# Altium schematic sheet blackfin_e_lcd_keypad.SchDoc: LCD, Keypad, Assembly
size A3; SheetNumber: 5; SheetTotal: 6
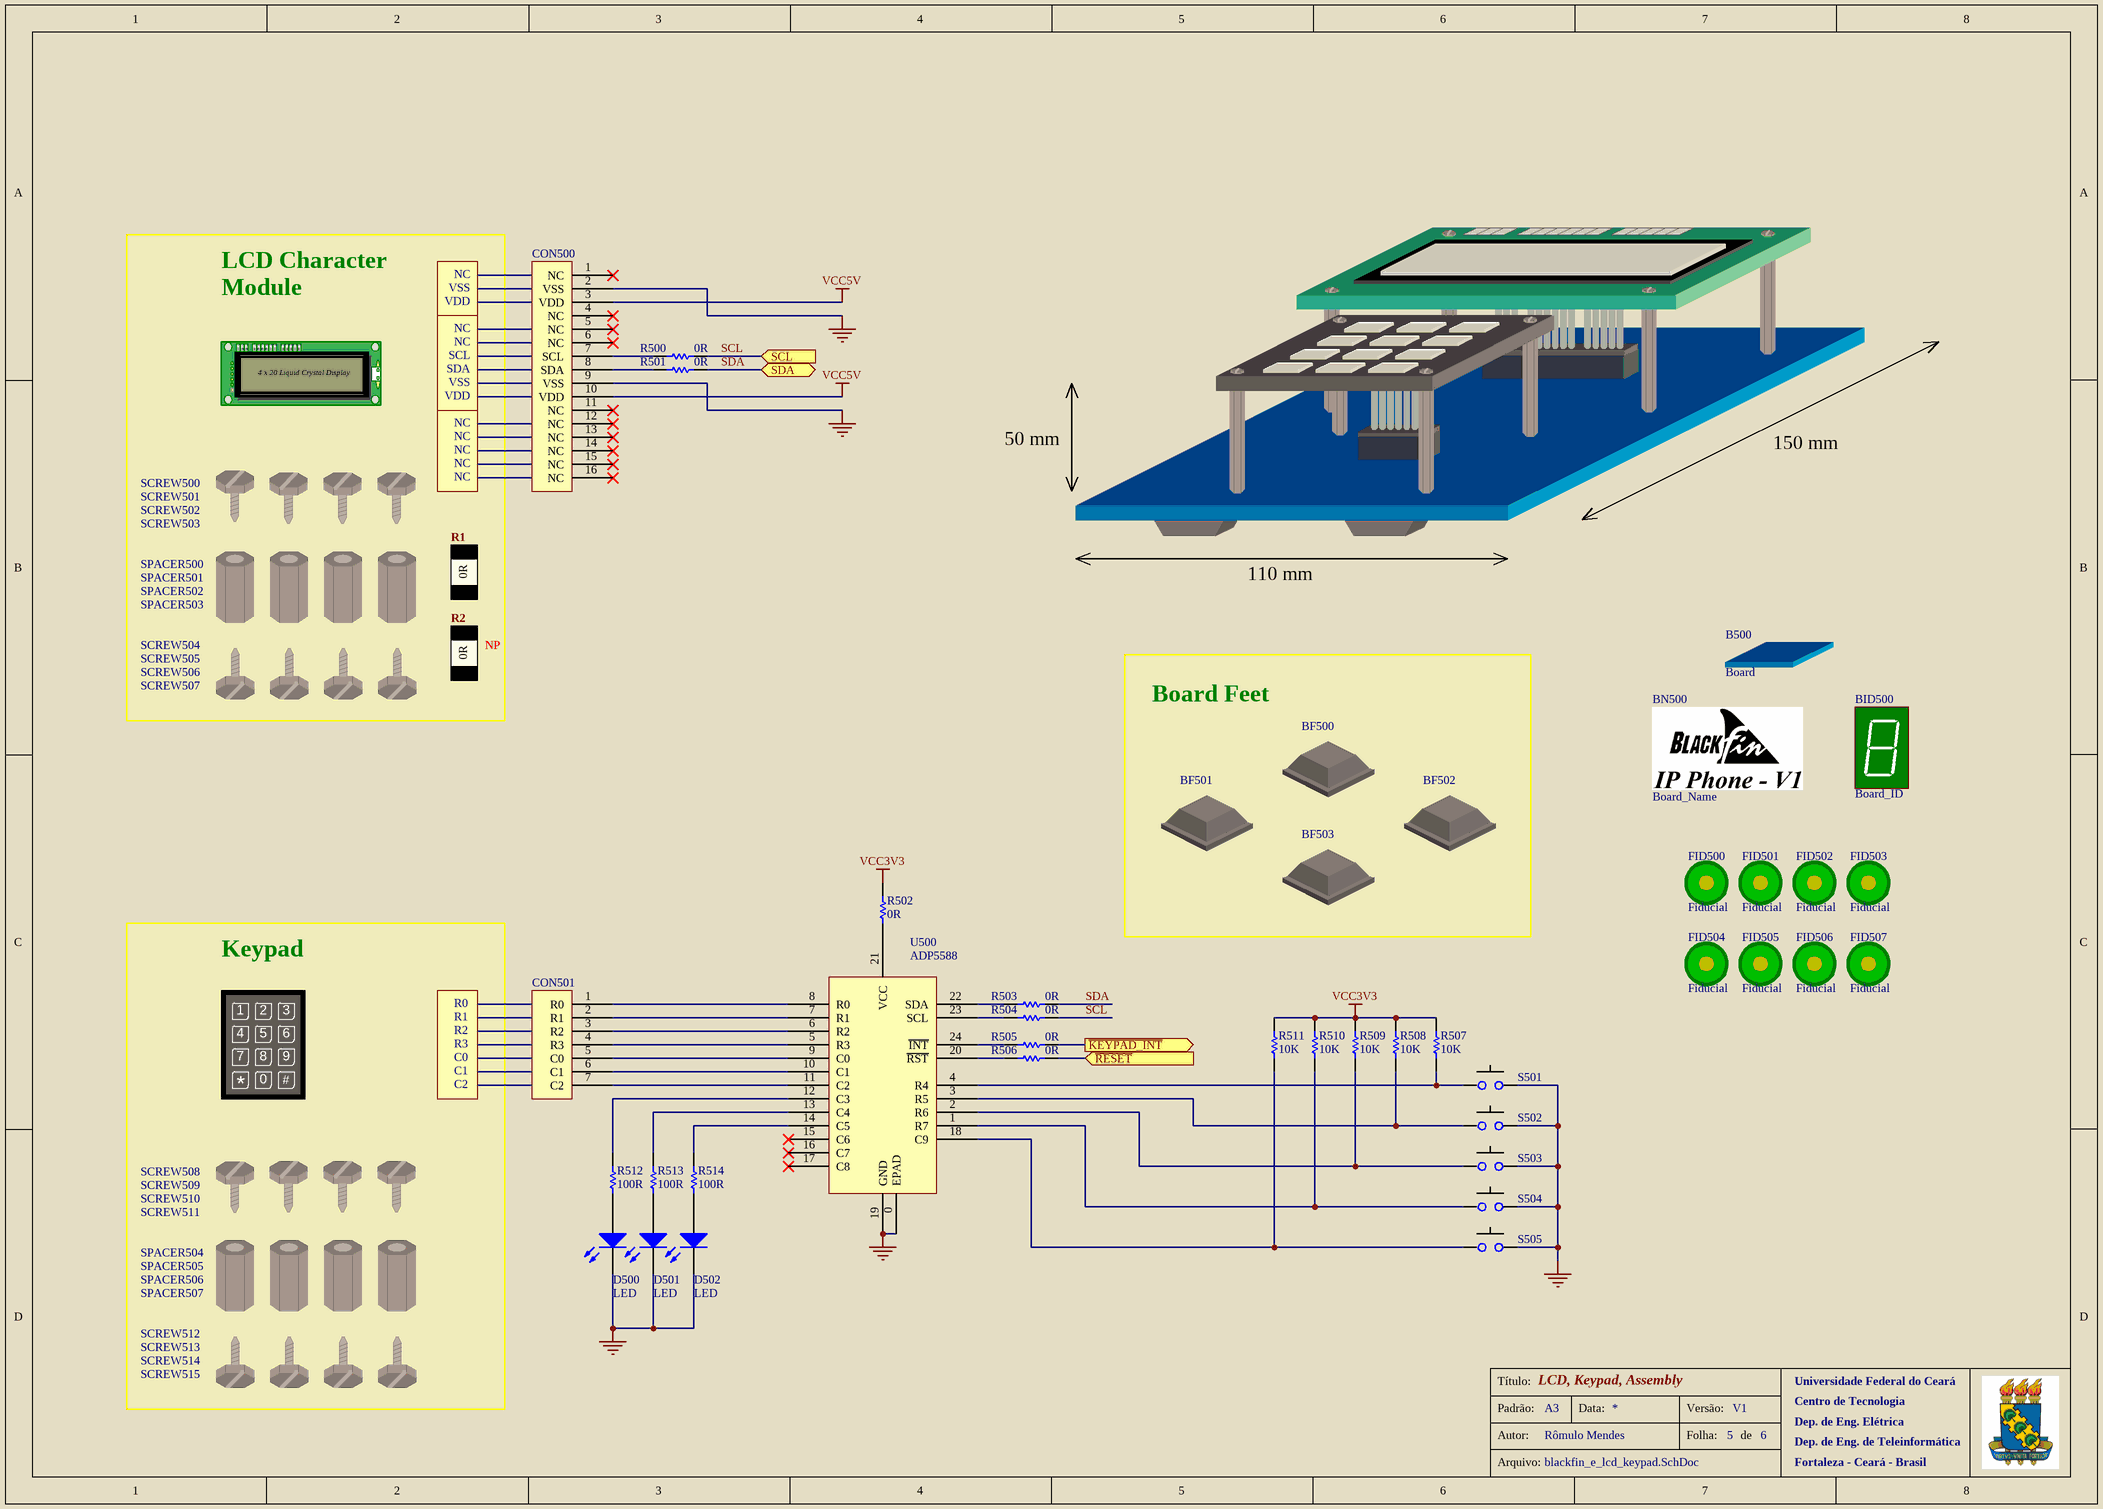
[diagram p0: blackfin_e_lcd_keypad.SchDoc]

## Parts
B500  Board  (mechanical)
BF500  Board Foot  [Board Foot (Hemisphere)]  (value not drawn)
BF501  Board Foot  [Board Foot (Hemisphere)]  (value not drawn)
BF502  Board Foot  [Board Foot (Hemisphere)]  (value not drawn)
BF503  Board Foot  [Board Foot (Hemisphere)]  (value not drawn)
BID500  Board_ID  [BOARD_ID]  (no BOM)
BN500  Board_Name  [LOGO]  (no BOM)
CON500  LCD_Connector  [SOCKET_1x16]  (value not drawn)
CON501  Keypad_Connector  [SOCKET_1x7]  (value not drawn)
D500  LED  [LED_0603]
D501  LED  [LED_0603]
D502  LED  [LED_0603]
FID500  Fiducial  [Fiducial]  (no BOM)
FID501  Fiducial  [Fiducial]  (no BOM)
FID502  Fiducial  [Fiducial]  (no BOM)
FID503  Fiducial  [Fiducial]  (no BOM)
FID504  Fiducial  [Fiducial]  (no BOM)
FID505  Fiducial  [Fiducial]  (no BOM)
FID506  Fiducial  [Fiducial]  (no BOM)
FID507  Fiducial  [Fiducial]  (no BOM)
KEYPAD_HEADER500  Keypad_Header_1x7  (value not drawn)  (mechanical)
LCD500  LCD  [LCD]  (value not drawn)
LCD_HEADER500  LCD_Header_1x3  (value not drawn)  (mechanical)
LCD_HEADER501  LCD_Header_1x6  (value not drawn)  (mechanical)
LCD_HEADER502  LCD_Header_1x5  (value not drawn)  (mechanical)
LCD_RES500  LCD_Resistor  (value not drawn)  (mechanical)
LCD_RES501  LCD_Resistor  (value not drawn)  (mechanical)
R500  0R  [R_0603]
R501  0R  [R_0603]
R502  0R  [R_0603]
R503  0R  [R_0603]
R504  0R  [R_0603]
R505  0R  [R_0603]
R506  0R  [R_0603]
R507  10K  [R_0603]
R508  10K  [R_0603]
R509  10K  [R_0603]
R510  10K  [R_0603]
R511  10K  [R_0603]
R512  100R  [R_0603]
R513  100R  [R_0603]
R514  100R  [R_0603]
S500  Keypad  [Keypad]  (value not drawn)
S501  Push Button  [Push Button]  (value not drawn)
S502  Push Button  [Push Button]  (value not drawn)
S503  Push Button  [Push Button]  (value not drawn)
S504  Push Button  [Push Button]  (value not drawn)
S505  Push Button  [Push Button]  (value not drawn)
SCREW500  Screw  (value not drawn)  (mechanical)
SCREW501  Screw  (value not drawn)  (mechanical)
SCREW502  Screw  (value not drawn)  (mechanical)
SCREW503  Screw  (value not drawn)  (mechanical)
SCREW504  Screw  (value not drawn)  (mechanical)
SCREW505  Screw  (value not drawn)  (mechanical)
SCREW506  Screw  (value not drawn)  (mechanical)
SCREW507  Screw  (value not drawn)  (mechanical)
SCREW508  Screw  (value not drawn)  (mechanical)
SCREW509  Screw  (value not drawn)  (mechanical)
SCREW510  Screw  (value not drawn)  (mechanical)
SCREW511  Screw  (value not drawn)  (mechanical)
SCREW512  Screw  (value not drawn)  (mechanical)
SCREW513  Screw  (value not drawn)  (mechanical)
SCREW514  Screw  (value not drawn)  (mechanical)
SCREW515  Screw  (value not drawn)  (mechanical)
SPACER500  Spacer  (value not drawn)  (mechanical)
SPACER501  Spacer  (value not drawn)  (mechanical)
SPACER502  Spacer  (value not drawn)  (mechanical)
SPACER503  Spacer  (value not drawn)  (mechanical)
SPACER504  Spacer  (value not drawn)  (mechanical)
SPACER505  Spacer  (value not drawn)  (mechanical)
SPACER506  Spacer  (value not drawn)  (mechanical)
SPACER507  Spacer  (value not drawn)  (mechanical)
U500  ADP5588  [QFN-24]

## Blocks framed on the sheet
Board Feet: BF500-BF503
Keypad: KEYPAD_HEADER500 S500 SCREW508-SCREW515 SPACER504-SPACER507

## Ports
SCL (in), SDA (bidir), ~{KEYPAD_INT} (out), ~{RESET} (in)

## Nets
GND: CON500.2(VSS) CON500.9(VSS) D500.2(K) D501.2(K) D502.2(K) S501.2 S502.2 S503.2 S504.2 S505.2 U500.0(EPAD) U500.19(GND)
VCC3V3: R502.2 R507.1 R508.1 R509.1 R510.1 R511.1
VCC5V: CON500.3(VDD) CON500.10(VDD)
~{KEYPAD_INT}: R505.2 ; port ~{KEYPAD_INT}
~{RESET}: R506.2 ; port ~{RESET}
SCL: R500.2 R504.2 ; port SCL
SDA: R501.2 R503.2 ; port SDA
NetCON500_7: CON500.7(SCL) R500.1
NetCON500_8: CON500.8(SDA) R501.1
NetCON501_1: CON501.1(R0) U500.8(R0)
NetCON501_2: CON501.2(R1) U500.7(R1)
NetCON501_3: CON501.3(R2) U500.6(R2)
NetCON501_4: CON501.4(R3) U500.5(R3)
NetCON501_5: CON501.5(C0) U500.9(C0)
NetCON501_6: CON501.6(C1) U500.10(C1)
NetCON501_7: CON501.7(C2) U500.11(C2)
NetD500_1: D500.1(A) R512.1
NetD501_1: D501.1(A) R513.1
NetD502_1: D502.1(A) R514.1
NetR502_1: R502.1 U500.21(VCC)
NetR503_1: R503.1 U500.22(SDA)
NetR504_1: R504.1 U500.23(SCL)
NetR505_1: R505.1 U500.24(~{INT})
NetR506_1: R506.1 U500.20(~{RST})
NetR507_2: R507.2 S501.1 U500.4(R4)
NetR508_2: R508.2 S502.1 U500.3(R5)
NetR509_2: R509.2 S503.1 U500.2(R6)
NetR510_2: R510.2 S504.1 U500.1(R7)
NetR511_2: R511.2 S505.1 U500.18(C9)
NetR512_2: R512.2 U500.12(C3)
NetR513_2: R513.2 U500.13(C4)
NetR514_2: R514.2 U500.14(C5)

Not connected (* = marked no-connect by the designer): CON500 1(NC)* 4(NC)* 5(NC)* 6(NC)* 11(NC)* 12(NC)* 13(NC)* 14(NC)* 15(NC)* 16(NC)*; U500 15(C6)* 16(C7)* 17(C8)*

## Notes on the sheet
- LCD Character
- (near LCD500) Module
- 50 mm
- 150 mm
- (near LCD_RES500) R1
- 110 mm
- (near LCD_RES501) R2
- (near LCD_RES501) NP
- Título:
- Universidade Federal do Ceará
- Padrão:
- Autor:
- A3
- Rômulo Mendes
- Data:
- Versão:
- Folha:
- V1
- de
- Centro de Tecnologia
- Dep. de Eng. Elétrica
- Dep. de Eng. de Teleinformática
- Arquivo:
- Fortaleza - Ceará - Brasil
- (in symbol Keypad) 1; 2; 3; 4; 5; 6; 7; 8; 9; 0; #
- (in symbol Keypad_Header_1x7) R0; R1; R2; R3; C0; C1; C2
- (in symbol LCD) 1; 2; 3; 5; 6; 7; 8; 9; 10; 12; 13; 14; 15; 16; 4 x 20 Liquid Crystal Display
- (in symbol LCD_Header_1x3) NC; VSS; VDD
- (in symbol LCD_Header_1x5) NC
- (in symbol LCD_Header_1x6) NC; SCL; SDA; VSS; VDD
- (in symbol LCD_Resistor) 0R

## Library data of the parts
B500 = Board: eVendor: NÃO SE APLICA; eVendorPrice: 0,00; eVendorPart#: NÃO SE APLICA; Part#: NÃO SE APLICA; MOQ: 1000; MSRP: 0,00; Manufacturer: NÃO SE APLICA
BF500-BF503 = Board Foot: eVendorPart#: 517-SJ-5003BK; Part#: SJ-5003 (BLACK); Manufacturer: 3M Electronic Specialty; eVendorPrice: 0,18; eVendor: Mouser; MSRP: 0,07; MOQ: 1000
BID500 = Board_ID: eVendor: NÃO SE APLICA; eVendorPrice: 0,00; eVendorPart#: NÃO SE APLICA; Part#: NÃO SE APLICA; Manufacturer: NÃO SE APLICA; MOQ: 1000; MSRP: 0,00
BN500 = Board_Name: eVendor: NÃO SE APLICA; eVendorPrice: 0,00; eVendorPart#: NÃO SE APLICA; Manufacturer: NÃO SE APLICA; MOQ: 1000; MSRP: 0,00; Part#: NÃO SE APLICA
CON500 = LCD_Connector: eVendorPart#: SSM-116-L-SV; Manufacturer: Samtec; eVendor: Techso; eVendorPrice: 1,55; MSRP: 1,29; MOQ: 1000; Part#: SSM-116-L-SV
CON501 = Keypad_Connector: eVendorPart#: SSM-107-L-SV; Manufacturer: Samtec; eVendor: Techso; eVendorPrice: 0,881; MSRP: 0,729; MOQ: 1000; Part#: SSM-107-L-SV
D500-D502 = LED: Red LED; eVendorPart#: 638-QTLP600C2TR; Manufacturer: Everlight; Part#: QTLP600C2TR; eVendor: Mouser; eVendorPrice: 0,22; MSRP: 0,083; MOQ: 1000
FID500-FID507 = Fiducial: eVendorPart#: NÃO SE APLICA; MSRP: 0,00; Manufacturer: NÃO SE APLICA; MOQ: 1000; Part#: NÃO SE APLICA; eVendor: NÃO SE APLICA; eVendorPrice: 0,00
KEYPAD_HEADER500 = Keypad_Header_1x7: eVendorPart#: ESQ-107-34-L-S; Manufacturer: Samtec; eVendor: Techso; eVendorPrice: 0,916; MSRP: 0,756; MOQ: 1000; Part#: ESQ-107-34-L-S
LCD500 = LCD: eVendorPart#: 763-0420D3Z-FL-GBW; Part#: NHD-0420D3Z-FL-GBW; Manufacturer: Newhaven; eVendor: Mouser; MSRP: 25,60; eVendorPrice: 31,75; MOQ: 1000
LCD_HEADER500 = LCD_Header_1x3: eVendorPart#: DW-03-12-F-S-694; Manufacturer: Samtec; eVendor: Techso; eVendorPrice: 0,173; MSRP: 0,144; MOQ: 1000; Part#: DW-03-12-F-S-694
LCD_HEADER501 = LCD_Header_1x6: eVendorPart#: DW-06-12-F-S-694; Manufacturer: Samtec; eVendor: Techso; eVendorPrice: 0,347; MSRP: 0,287; MOQ: 1000; Part#: DW-06-12-F-S-694
LCD_HEADER502 = LCD_Header_1x5: eVendorPart#: DW-05-12-F-S-694; Manufacturer: Samtec; eVendor: Techso; eVendorPrice: 0,289; MSRP: 0,239; MOQ: 1000; Part#: DW-05-12-F-S-694
LCD_RES500 LCD_RES501 = LCD_Resistor: eVendorPart#: 71-CRCW0805-0-E3; Manufacturer: Vishay/Dale; Part#: CRCW08050000Z0EA; eVendor: Mouser; eVendorPrice: 0,05; MSRP: 0,008; MOQ: 1000
R500-R506 = Resistor: eVendorPart#: 71-CRCW06030000Z0EB; Part#: CRCW06030000Z0EB; Manufacturer: Vishay/Dale; eVendor: Mouser; eVendorPrice: 0,06; MSRP: 0,015; MOQ: 1000
R507-R511 = Resistor: eVendorPart#: 71-CRCW0603-10K-E3; Part#: CRCW060310K0FKEA; Manufacturer: Vishay/Dale; eVendor: Mouser; eVendorPrice: 0,06; MSRP: 0,015; MOQ: 1000
R512-R514 = Resistor: eVendorPart#: 71-CRCW0603-100-E3; Part#: CRCW0603100RFKEA; Manufacturer: Vishay/Dale; eVendor: Mouser; eVendorPrice: 0,06; MSRP: 0,015; MOQ: 1000
S500 = Keypad: eVendorPart#: GH5009-ND; Part#: 96AB2-152-R; Manufacturer: Grayhill Inc; eVendor: Digikey; eVendorPrice: 12,26; MSRP: 6,6228; MOQ: 1000
S501-S505 = Push Button: eVendorPart#: 611-PTS645SH50SMTRLF; Part#: PTS645SH50SMTRLFS; Manufacturer: C&K Components; eVendor: Mouser; MSRP: 0,135; eVendorPrice: 0,27; MOQ: 1000
SCREW500-SCREW515 = Screw: eVendorPart#: 534-29301; Part#: 29301; Manufacturer: Keystone Electronics; eVendor: Mouser; eVendorPrice: 0,28; MSRP: 0,14; MOQ: 1000
SPACER500-SPACER507 = Spacer: eVendorPart#: 534-24428; Manufacturer: Keystone Electronics; Part#: 24428; eVendor: Mouser; eVendorPrice: 0,60; MSRP: 0,30; MOQ: 1000
U500 = ADP5588: eVendorPart#: ADP5588ACPZ-R7CT-ND; Part#: ADP5588ACPZ-R7; Manufacturer: Analog Devices; eVendor: Digikey; MSRP: 1,56; eVendorPrice: 2,70; MOQ: 1000